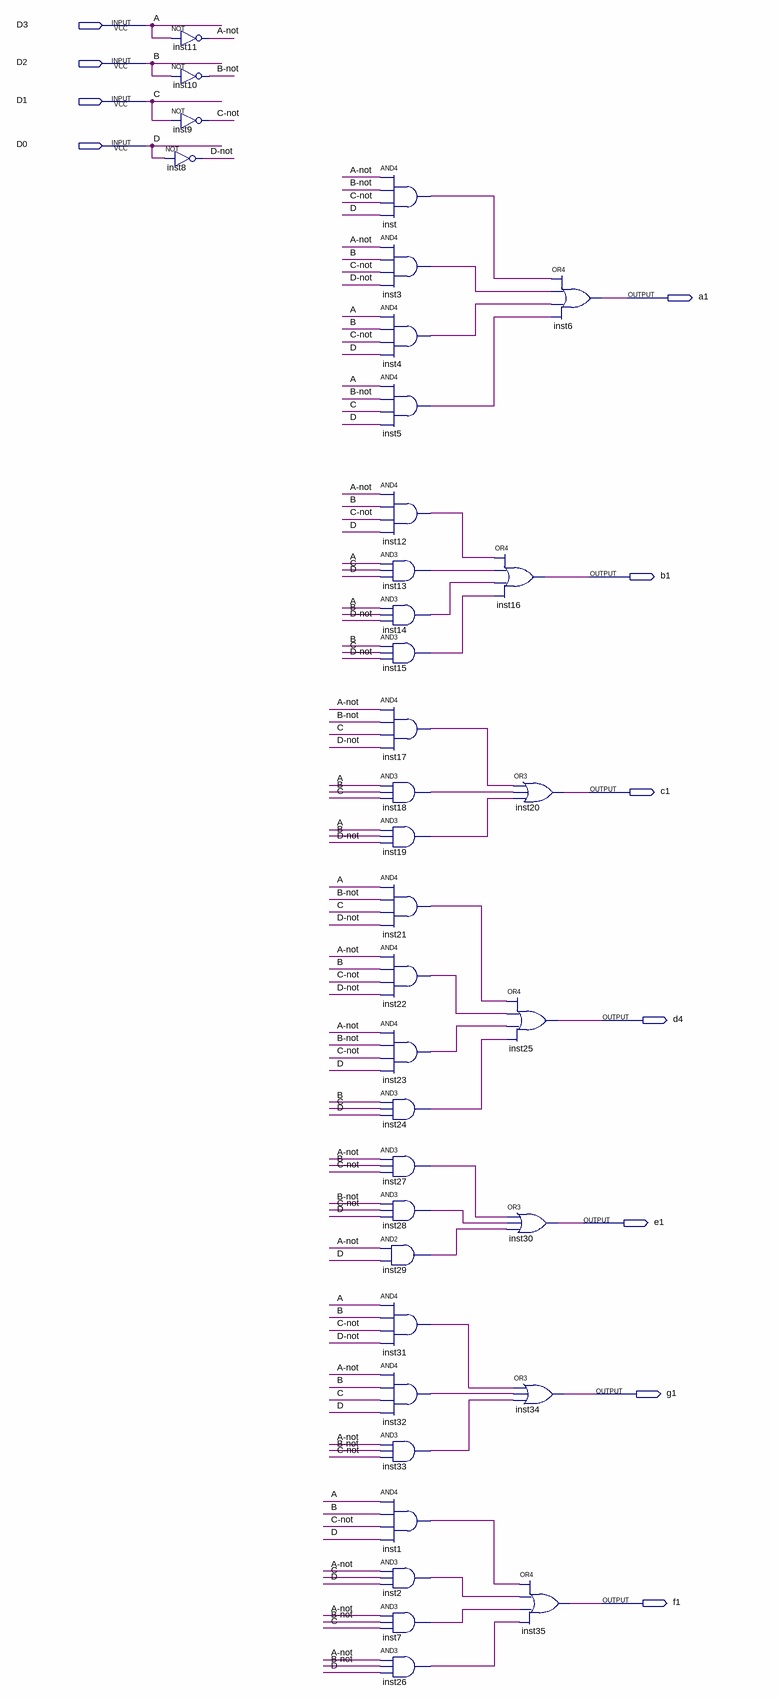
[diagram p0: schematic sheet]
// Quartus schematic display7seg.bdf as structural Verilog: 36 symbols, 11 pins
module display7seg (
  input  D3,
  input  D2,
  input  D1,
  input  D0,
  output a1,
  output b1,
  output c1,
  output d4,
  output e1,
  output g1,
  output f1
);

  wire \A-not , \B-not , \C-not , \D-not , inst1_out, inst2_out, inst3_out, inst4_out, inst5_out, inst7_out,
       inst12_out, inst13_out, inst14_out, inst15_out, inst17_out, inst18_out, inst19_out, inst21_out,
       inst22_out, inst23_out, inst24_out, inst26_out, inst27_out, inst28_out, inst29_out, inst31_out,
       inst32_out, inst33_out, inst_out;

  not inst11 (\A-not , D3);
  not inst10 (\B-not , D2);
  not inst9 (\C-not , D1);
  not inst8 (\D-not , D0);
  and inst (inst_out, \A-not , \B-not , \C-not , D0);
  and inst3 (inst3_out, \A-not , D2, \C-not , \D-not );
  and inst4 (inst4_out, D3, D2, \C-not , D0);
  and inst5 (inst5_out, D3, \B-not , D1, D0);
  and inst12 (inst12_out, \A-not , D2, \C-not , D0);
  and inst13 (inst13_out, D3, D1, D0);
  and inst14 (inst14_out, D3, D2, \D-not );
  and inst15 (inst15_out, D2, D1, \D-not );
  and inst17 (inst17_out, \A-not , \B-not , D1, \D-not );
  and inst18 (inst18_out, D3, D2, D1);
  and inst19 (inst19_out, D3, D2, \D-not );
  and inst21 (inst21_out, D3, \B-not , D1, \D-not );
  and inst22 (inst22_out, \A-not , D2, \C-not , \D-not );
  and inst23 (inst23_out, \A-not , \B-not , \C-not , D0);
  and inst24 (inst24_out, D2, D1, D0);
  and inst27 (inst27_out, \A-not , D2, \C-not );
  and inst28 (inst28_out, \B-not , \C-not , D0);
  and inst29 (inst29_out, \A-not , D0);
  and inst31 (inst31_out, D3, D2, \C-not , \D-not );
  and inst32 (inst32_out, \A-not , D2, D1, D0);
  and inst33 (inst33_out, \A-not , \B-not , \C-not );
  and inst1 (inst1_out, D3, D2, \C-not , D0);
  and inst2 (inst2_out, \A-not , D1, D0);
  and inst7 (inst7_out, \A-not , \B-not , D1);
  and inst26 (inst26_out, \A-not , \B-not , D0);
  or inst16 (b1, inst12_out, inst13_out, inst14_out, inst15_out);
  or inst25 (d4, inst21_out, inst22_out, inst23_out, inst24_out);
  or inst30 (e1, inst27_out, inst28_out, inst29_out);
  or inst6 (a1, inst_out, inst3_out, inst4_out, inst5_out);
  or inst20 (c1, inst17_out, inst18_out, inst19_out);
  or inst34 (g1, inst31_out, inst32_out, inst33_out);
  or inst35 (f1, inst1_out, inst2_out, inst7_out, inst26_out);

  // Other names for the same wires on the sheet: D = D0; C = D1; B = D2; A = D3
endmodule
